# Altium schematic sheet TM.SchDoc
size A; SheetNumber: 1; SheetTotal: 1
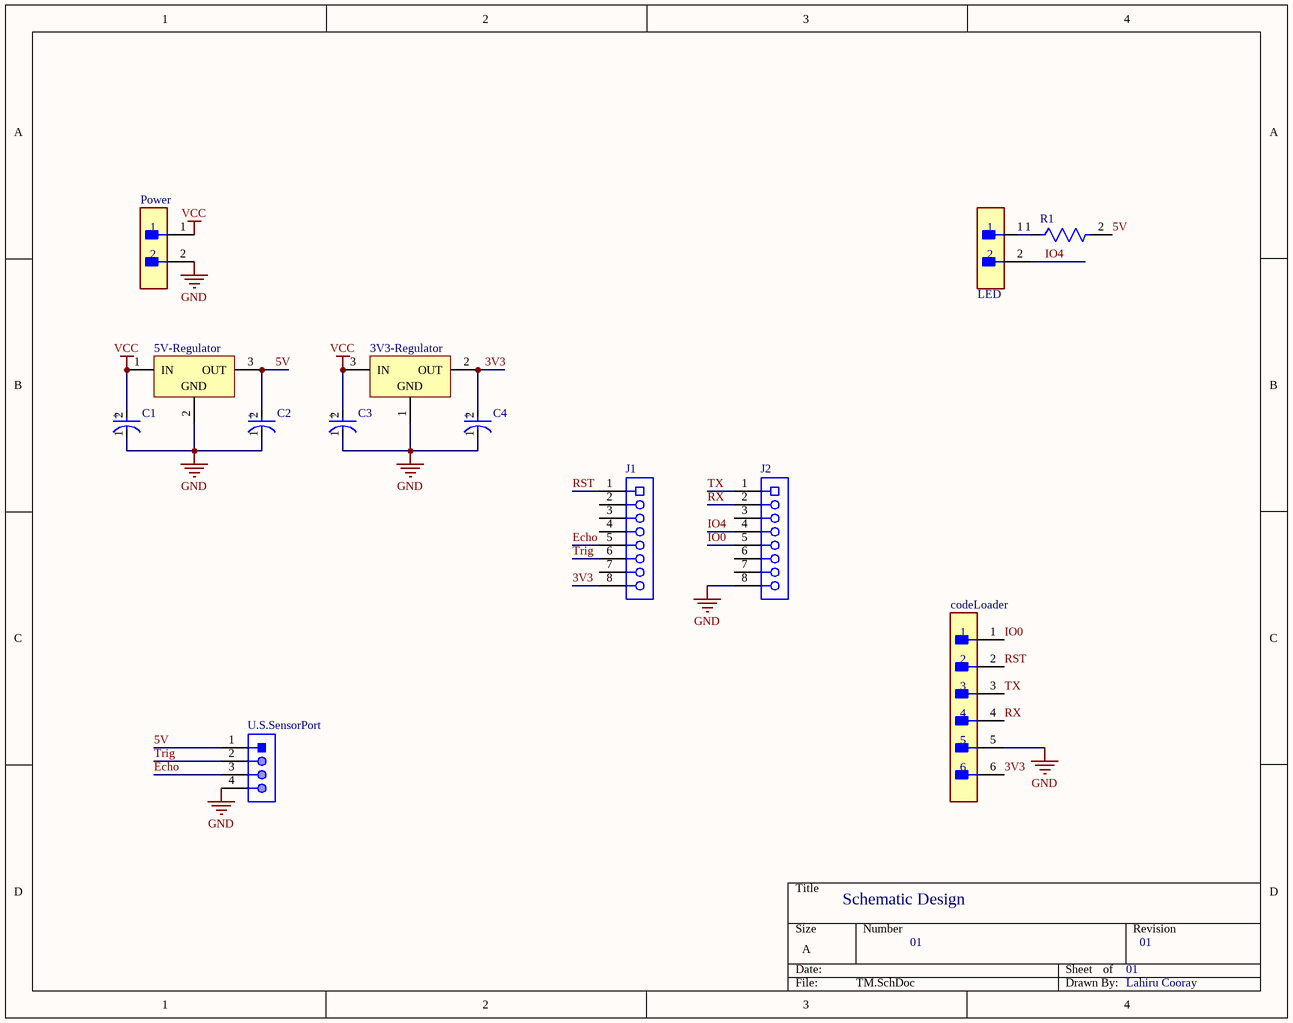
[diagram p0: TM.SchDoc]

## Parts
3V3-Regulator  LM1117T-3.3/NOPB  [NDE0003A]  (value not drawn)
5V-Regulator  L7805CV  [TO220]  (value not drawn)
C1  EEUHD1H330  [FP-RAD-TH-D_5_0_5-L_11_1-MFG]  (value not drawn)
C2  EEUHD1H330  [FP-RAD-TH-D_5_0_5-L_11_1-MFG]  (value not drawn)
C3  EEUHD1H330  [FP-RAD-TH-D_5_0_5-L_11_1-MFG]  (value not drawn)
C4  EEUHD1H330  [FP-RAD-TH-D_5_0_5-L_11_1-MFG]  (value not drawn)
codeLoader  22-28-4063  [FP-22-28-4063-MFG]  (value not drawn)
J1  PPPC081LFBN-RC  [SLIN-PPPC081LFBN-RC_V]  (value not drawn)
J2  PPPC081LFBN-RC  [SLIN-PPPC081LFBN-RC_V]  (value not drawn)
LED  M20-9990246  [FP-M20-9990246-MFG]  (value not drawn)
Power  M20-9990246  [FP-M20-9990246-MFG]  (value not drawn)
R1  MRS25000C9530FCT00  [FP-MRS25-MFG]  (value not drawn)
U.S.SensorPort  61300411121  [61300411121]  (value not drawn)

## Nets
GND: 3V3-Regulator.1(GND) 5V-Regulator.2(GND) C1.1(C) C2.1(C) C3.1(C) C4.1(C) codeLoader.5 J2.8 Power.2 U.S.SensorPort.4
VCC: 3V3-Regulator.3(IN) 5V-Regulator.1(IN) C1.2(A) C3.2(A) Power.1
3V3: 3V3-Regulator.2(OUT) C4.2(A) codeLoader.6 J1.8
5V: 5V-Regulator.3(OUT) C2.2(A) R1.2 U.S.SensorPort.1
Echo: J1.5 U.S.SensorPort.3
IO0: codeLoader.1 J2.5
IO4: J2.4 LED.2
RST: codeLoader.2 J1.1
RX: codeLoader.4 J2.2
Trig: J1.6 U.S.SensorPort.2
TX: codeLoader.3 J2.1
NetLED_1: LED.1 R1.1

Not connected (* = marked no-connect by the designer): J1 2 3 4 7; J2 3 6 7

## Notes on the sheet
- Schematic Design
- 01
- Lahiru Cooray
- (in symbol CMP-05427-001662-1) +

## Library data of the parts
3V3-Regulator = CMP-0062-02494-3: 800mA Low-Dropout Linear Regulator, 3-pin TO-220, Pb-Free; Manufacturer: Texas Instruments; PackageTopMarking: NSUZXYTTE#*LM1117T*3.3; PowerWise: N; CompType: LDO IC; RoHS: Y; ComponentLink1URL: http://www.ti.com/general/docs/lit/getliterature.tsp?genericPartNumber=LM1117-N&fileType=pdf; PackageReference: NDE0003A; PinCount: 3; ComponentLink1Description: Datasheet URL; PackageDescription: TO-220, Molded, 3 Lead, Straight
5V-Regulator = CMP-0244-00483-1: Positive Voltage Regulator, 5V, 3-Pin TO-220; PackageDescription: TO, Thru-Hole, Vertical, Heatsink Mounted; 3 In-Line Leads; Pitch 2.54 mm; ComponentLink2Description: Datasheet; PackageReference: TO220; ComponentLink3URL: http://www.st.com/internet/com/TECHNICAL_RESOURCES/TECHNICAL_LITERATURE/PACKAGE_INFORMATION/CD00004649.pdf; DatasheetVersion: 16/11/2011; ComponentLink1Description: Manufacturer URL; ComponentLink1URL: http://www.st.com; PackageVersion: ver3.0; ComponentLink3Description: Package Specification; ComponentLink2URL: http://www.st.com/internet/com/TECHNICAL_RESOURCES/TECHNICAL_LITERATURE/DATASHEET/CD00000444.pdf
C1-C4 = CMP-05427-001662-1: Aluminum Electrolytic Capacitors (Radial Lead Type) AEC-Q200 Qualified 33uF ±20% 50V; Life (Hours): 1000Hour; Polarity: Polar; Ripple Current: 90mA; Lead/Base Style: Straight; Lead Diameter: 0.5mm; Height - Seated (Max): 0.492inch; REACH SVHC: No SVHC; Mount: Through Hole; Diameter: 5mm; Tolerance: 20%; Package Quantity: 200; Voltage Rating: 50V; Min Operating Temperature: -55°C; Series: HD; Length: 11mm; Voltage: 50V; Termination: Radial; Lead Pitch: 2.5mm; Capacitance: 33uF; Packaging: Bulk; Voltage Rating (DC): 50V; Case/Package: Radial; Max Operating Temperature: 105°C; Height: 11mm; Construction: RADIAL; RoHS Compliant: Yes; Ripple Current (AC): 90mA
codeLoader = CMP-04776-000885-1: CONN HEADER VERT 6POS 2.54MM; Number of Circuits: 6; Voltage Rating (DC): 250V; Connector Type: Male Pin; Contact Resistance: 20mR; Glow Wire Compliant: Non-compliant; Gender: Male; Current Rating: 4A; Max Voltage Rating (DC): 250.25kV; Series: KK® 42375; Termination: Solder; Orientation: Straight; Max Operating Temperature: 75°C; Min Operating Temperature: 0°C; Mount: Through Hole; Depth: 2.49mm; Contact Material: Brass; Number of Positions: 6; Contact Mating Length: 0.24inch; Number of Rows: 1; Housing Color: Black; Max Voltage Rating (AC): 250V; Housing Material: Thermoplastic; Packaging: Bulk; Contact Plating: Gold; Contact Type: Male Pin; Package Quantity: 1; Number of Contacts: 6; Voltage Rating: 250V; Lead Free: Lead Free; RoHS Compliant: Yes; Pitch: 2.54mm; Color: Black; Flammability Rating: UL94 V-0; Radiation Hardening: No
J1 J2 = CMP-1770-00002-1: Female Header, Pitch 2.54 mm, 1 x 8 Position, Height 8.5 mm, Tail Length 3.2 mm, -40 to 105 degC, RoHS, Bulk; Case\Package: TO-252-3; Rds On Max: 115 mohm; Typical Rise Time: 90 ns; Max Power Dissipation: 2.5 W; Input Capacitance: 350 pF; Elements: 1; Height: 2.39 mm; Min Operating Temperature: -55 degC; RoHSCompliant: true; PackageDescription: Female Header, Pitch 2.54 mm, 1 x 8 Position, Height 8.5 mm, Tail Length 3.2 mm; Length: 6.73 mm; ComponentLink1Description: Datasheet; Package Quantity: 2500; Max Operating Temperature: 150 degC; Width: 6.22 mm; Radiation Hardening: No; Packaging: Tape and Reel; REACH SVHC: No SVHC; Pins: 3; PackageReference: PPPC081LFBN-RC; ComponentLink1URL: http://sullinscorp.com/catalogs/101_PAGE114-115_.100_FEMALE_HDR.pdf; DatasheetVersion: Jan-15; Mount: Surface Mount
LED Power = CMP-15831-000009-1: CONN HEADER VERT 2POS 2.54MM; Manufacturer: Harwin; Conn Gender: Male; Conn Orientation: Vertical; Number Of Contacts: 2; Current Rating: 3A; ComponentLink2URL: https://cdn.harwin.com/pdfs/M20-999.pdf; ComponentLink2Description: Datasheet; Package: M20-9990246; Temperature: -40°C to +105°C; Octopart: https://octopart.com/m20-9990246-harwin-2590635; Mouser Description: 2.54mm (0.1") Pitch SIL Vertical PC Tail Pin Header, 6.1mm mating pin height, tin, 2 contacts; Temperature Range High: +105°C; Device Class L1: Connectors; RoHS: TRUE; Automotive: No; Height: 8.99mm; Number Of Rows: 1; Contact Material: Tin,Nickel; Category: Conn; Pitch: 2.54mm; Lead Free: Yes; Digikey Description: CONN HEADER VERT 2POS 2.54MM; Manufacturer Part Number: M20-9990246; Temperature Range Low: -40°C; Device Class L3: unset; Device Class L2: Headers and Wire Housings
R1 = CMP-02408-000049-1: RES 953 OHM 0.6W 1% AXIAL; Power Rating: 600mW; Voltage Rating: 350V; Resistance: 953R; Temperature Coefficient: 50ppm/°C; Lead Length: 26mm; Case/Package: Axial; Max Power Dissipation: 600mW; Series: MRS25; Resistance Tolerance: 1%; Packaging: Tape and Reel; Radiation Hardening: No; Min Operating Temperature: -55°C; Contact Plating: Tin; Max Operating Temperature: 155°C; Length: 6.5mm; Number of Terminations: 2; Width: 2.5mm; Construction: Cylindrical; Termination: Axial; RoHS Compliant: Yes; Lead Free: Lead Free; Military Standard: Not; Technology: THIN FILM; Diameter: 2.5mm; Tolerance: 1%; Resistor Type: Metal Film
U.S.SensorPort = CMP-1502-01064-1: THT Vertical Pin Header WR-PHD, Pitch 2.54 mm, Single Row, 4 pins; Manufacturer: Wurth Elektronik; Withstanding Voltage: 500VAC; Rated Current: 3A; Working Voltage: 250VAC; Pin Number: 4; Gender: Male; Contact Resistance: 20mOhm; Pitch: 2.54mm; Manufacturer URL: http://www.we-online.de; Operating Temperature: -40to105degC; Packaging: Bag; Mounting Technology: THT; Package Reference: 61300411121; Datasheet URL: https://katalog.we-online.de/em/datasheet/6130xx11121.pdf; Publisher: WurthElektronik; Part Number: 61300411121; Row Number: Single; Orientation: Vertical